# EAGLE design IOB-Outputs (EAGLE 7.7.0)
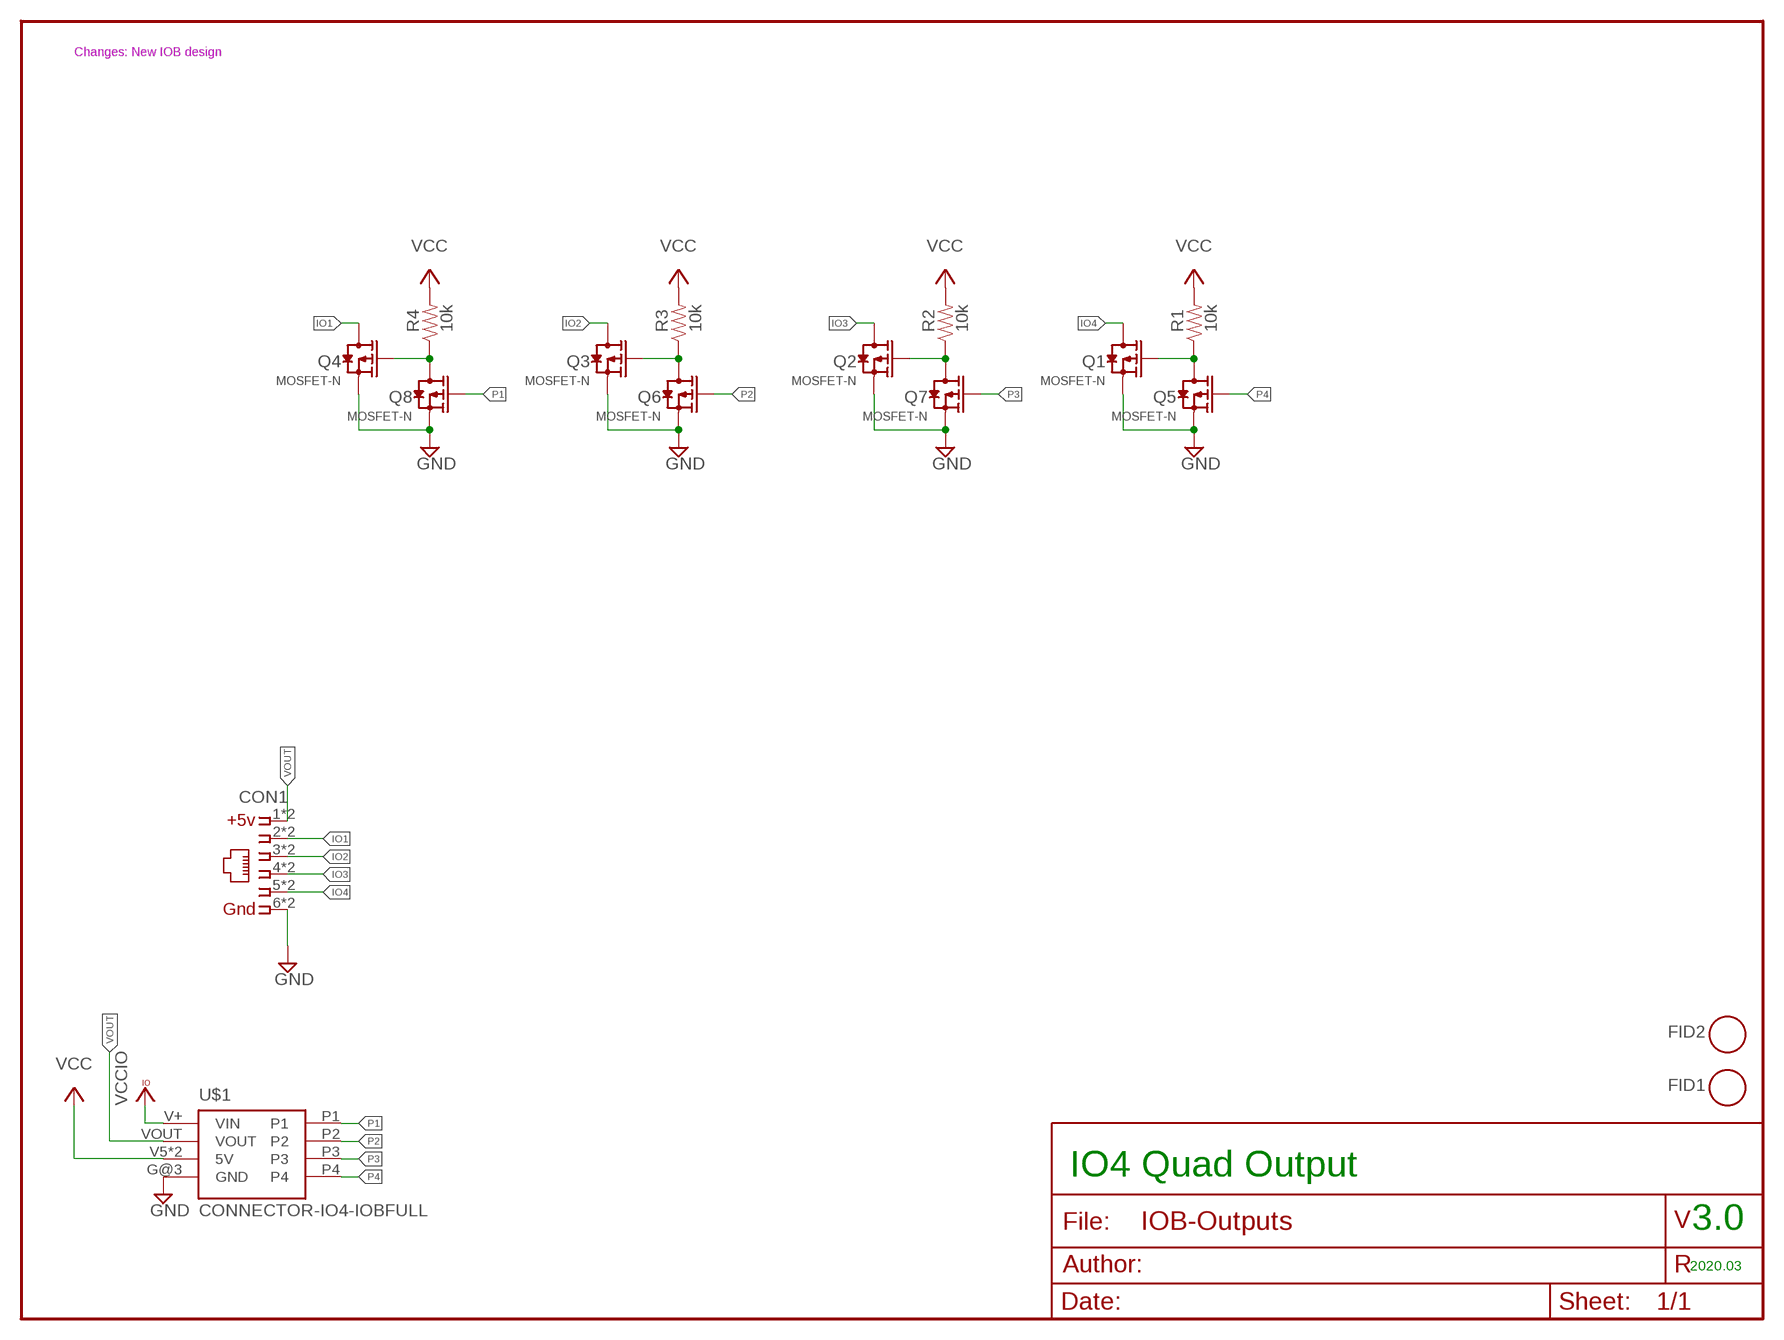
[diagram p0: schematic, sheet 1]

## Parts
CON1  CONNECTOR-IO4IPINS  [RJ24-INVERTED-PINS]
FID1  FIDUCIAL  [FIDUCIAL_1MM]
FID2  FIDUCIAL  [FIDUCIAL_1MM]
Q1  MOSFET-N  MOSFET-P  [SOT23-3]
Q2  MOSFET-N  MOSFET-P  [SOT23-3]
Q3  MOSFET-N  MOSFET-P  [SOT23-3]
Q4  MOSFET-N  MOSFET-P  [SOT23-3]
Q5  MOSFET-N  MOSFET-P  [SOT23-3]
Q6  MOSFET-N  MOSFET-P  [SOT23-3]
Q7  MOSFET-N  MOSFET-P  [SOT23-3]
Q8  MOSFET-N  MOSFET-P  [SOT23-3]
R1  10k  R0805-RES  [0805-RES]
R2  10k  R0805-RES  [0805-RES]
R3  10k  R0805-RES  [0805-RES]
R4  10k  R0805-RES  [0805-RES]
U$1  CONNECTOR-IO4-IOBFULL  [IO4-IOB]

## Nets
GND [Power]: CON1.6 CON1.6@1 Q1.2(S) Q2.2(S) Q3.2(S) Q4.2(S) Q5.2(S) Q6.2(S) Q7.2(S) Q8.2(S) U$1.G@3(GND)
IO1 [signals]: CON1.2 CON1.2@1 Q4.3(D)
IO2 [signals]: CON1.3 CON1.3@1 Q3.3(D)
IO3 [signals]: CON1.4 CON1.4@1 Q2.3(D)
IO4 [signals]: CON1.5 CON1.5@1 Q1.3(D)
N$1: Q4.1(G) Q8.3(D) R4.1
N$6: Q3.1(G) Q6.3(D) R3.1
N$7: Q2.1(G) Q7.3(D) R2.1
N$8: Q1.1(G) Q5.3(D) R1.1
P1 [signals]: Q8.1(G) U$1.P1
P2 [signals]: Q6.1(G) U$1.P2
P3 [signals]: Q7.1(G) U$1.P3
P4 [signals]: Q5.1(G) U$1.P4
VCC [Power]: R1.2 R2.2 R3.2 R4.2 U$1.V5(5V) U$1.V5@1(5V)
VIN: U$1.V+(VIN) ; supply symbol labelled VCCIO
VOUT: CON1.1 CON1.1@1 U$1.VOUT

## Notes on the sheet
- Changes: New IOB design
- IO4 Quad Output
- 3.0
- 2020.03

## Library data of the parts
CON1 = SPCoast:CONNECTOR-IO4
FID1 FID2 = SPCoast:FIDUCIAL: For use by pick and place machines to calibrate the vision/machine, 1mm By microbuilder.eu
Q1-Q8 = SPCoast:MOSFET-P: CJ2305：SMD MOSFET P-CH 8V-4.1A
R1-R4 = SPCoast:R*: Resistor Basic schematic elements and footprints for 0603, 1206, and PTH 1/10th watt (small) resistors.
U$1 = SPCoast:CONNECTOR-IO4-IOB

## Net classes
0 default: width 0.254 mm, drill 0.5 mm
1 Power: width 0.406 mm, drill 0.6 mm
2 signals: width 0.254 mm, drill 0.5 mm

## Board
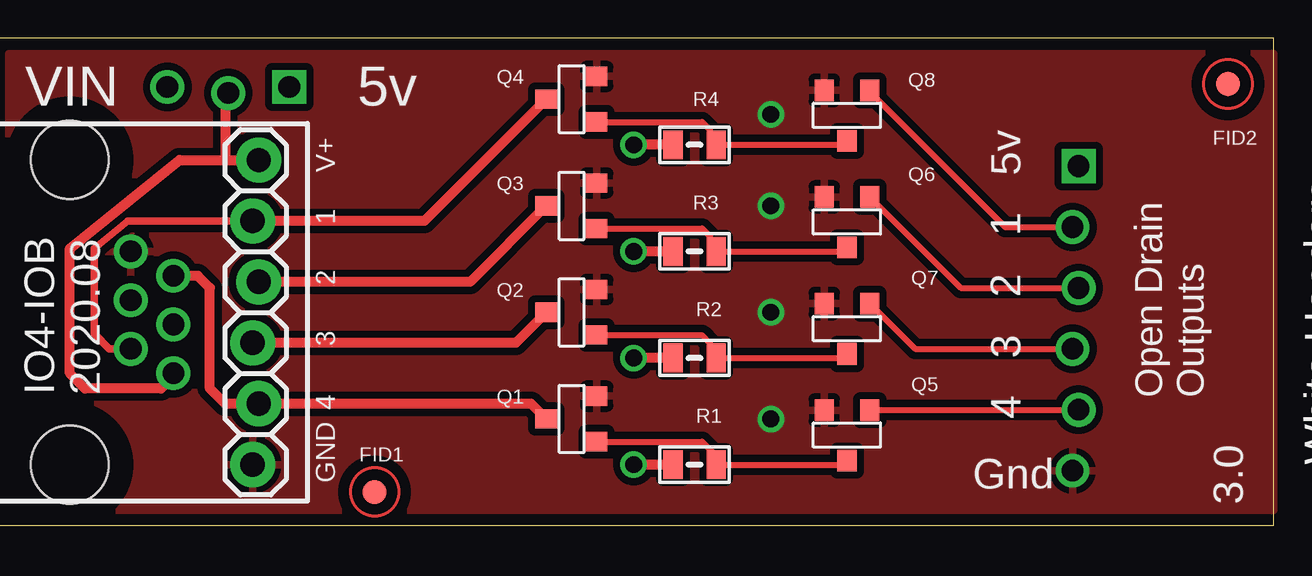
[diagram p1: board, top side]
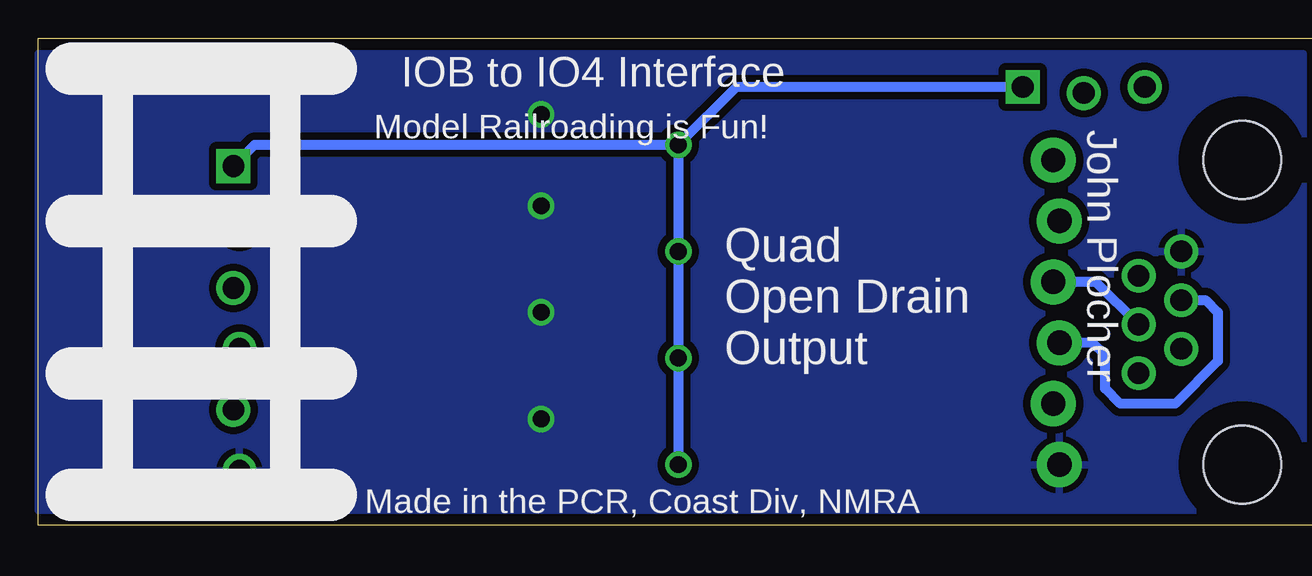
[diagram p2: board, bottom side, seen from below]

No outline drawn. Coordinates in mm, seen from the top.
Copper layers (1*16): Top 0.035mm / dielectric 1.5mm / Bottom 0.035mm
Design rules "default": minimum track width 10mil, minimum drill 24mil, track to track 8mil, track to pad 8mil, pad to pad 8mil, via to via 8mil, smd to smd 8mil, copper to edge 40mil, drill to drill 8mil, minimum pad ring 10mil, minimum via ring 8mil, stop-mask expansion 4mil, vias tented up to drill 0mil, thermal gap 10mil
Milling: 4 lines

### Footprints (pad centres in the part's own frame; a part is rotated, then mirrored left to right if it is on the bottom)
RJ24-INVERTED-PINS = drill 1.016 pad 1.88: 1 6.35,-4.064; 2 3.81,-3.81; 3 1.27,-4.064; 4 -1.27,-3.81; 5 -3.81,-4.064; 6 -6.35,-3.81 | drill 0.9 pad 1.4: 1@1 -2.54,-0.508; 2@1 -1.524,1.27; 3@1 -0.508,-0.508; 4@1 0.508,1.27; 5@1 1.524,-0.508; 6@1 2.54,1.27 | hole 3.251: 6.35,3.81; -6.35,3.81
FIDUCIAL_1MM = smd 1 x 1: 1 0,0
SOT23-3 = smd 0.9 x 0.8: 1 1,-0.95; 2 1,0.95; 3 -1.1,0
0805-RES = smd 0.8 x 1.2: 1 -0.9,0; 2 0.9,0
IO4-IOB = drill 0.9: G@3 44.958,2.286; P1 44.958,12.446; P2 45.212,9.906; P3 44.958,7.366; P4 45.212,4.826; V+ 7.239,18.288; VOUT 9.779,18.034 | drill 0.9 square: V5 12.319,18.288; V5@1 45.212,14.986

### Placement (x,y rotation side)
CON1  6.99,8.89 90 top
FID1  15.88,1.4 0 top
FID2  51.44,18.41 0 top
Q1  24.13,4.45 0 top
Q2  24.13,8.89 0 top
Q3  24.13,13.34 0 top
Q4  24.13,17.78 0 top
Q5  35.56,3.81 90 top
Q6  35.56,12.7 90 top
Q7  35.56,8.26 90 top
Q8  35.56,17.14 90 top
R1  29.21,2.54 180 top
R2  29.21,6.99 180 top
R3  29.21,11.43 180 top
R4  29.21,15.88 180 top
U$1  0,0 0 top

### Tracks (layer width: path | path; a pad name or v marks a point on that pad's centre or on a via)
GND  (via drill 0.7)
  Top 0.406: Q3.2 25.09,14.29 | Q2.2 25.09,9.84 | Q1.2 25.09,5.39
  other vias: 32.38,17.14 32.38,8.89 32.38,4.45 32.38,13.34
  pour Bottom (isolate 0.305): 0.64,0.64 0.64,19.68 53.34,19.68 53.34,0.64
  pour Top (isolate 0.305): 0.64,0.64 0.64,19.68 53.34,19.68 53.34,0.64
IO1
  Top 0.305: CON1.2@1 4.83,7.37 4.19,8 4.19,11.56 5.59,12.7 CON1.2
  Top 0.406: Q4.3 17.95,12.7 CON1.2
IO2
  Top 0.406: Q3.3 19.86,10.16 CON1.3
  Bottom 0.406: CON1.3@1 9.27,10.16 CON1.3
IO3
  Top 0.406: Q2.3 21.76,7.62 CON1.4
  Bottom 0.406: CON1.4@1 4.7,9.4 4.19,8.89 4.19,6.86 5.97,5.08 8.26,5.08 8.89,5.71 8.89,7.11 9.4,7.62 CON1.4
IO4
  Top 0.406: Q1.3 22.39,5.08 CON1.5 9.65,5.08 9.02,5.71 9.02,9.91 8.51,10.41 CON1.5@1
N$1
  Top 0.254: Q8.3 35.39,15.88 R4.1 29.84,16.14 29.84,16.51 29.52,16.83 Q4.1
N$6
  Top 0.254: Q6.3 35.39,11.43 R3.1 29.84,11.7 29.84,12.06 29.52,12.38 Q3.1
N$7
  Top 0.254: Q7.3 35.39,6.99 R2.1 29.84,7.25 29.84,7.62 29.52,7.94 Q2.1
N$8
  Top 0.254: 30.48,2.54 35.39,2.54 Q5.3 | Q1.1 29.52,3.5 30.48,2.54 | 30.48,2.54 R1.1
P1
  Top 0.254: Q8.1 36.51,18.1 42.16,12.45 U$1.P1
P2
  Top 0.254: Q6.1 40.3,9.91 U$1.P2
P3
  Top 0.254: Q7.1 38.4,7.37 U$1.P3
P4
  Top 0.254: Q5.1 36.53,4.83 U$1.P4
VCC  (via drill 0.7)
  Top 0.406: R4.2 v26.67,15.88 | R3.2 v26.67,11.43 | R2.2 v26.67,6.99 | R1.2 v26.67,2.54
  Bottom 0.406: v26.67,15.88 v26.67,11.43 v26.67,6.99 v26.67,2.54 | U$1.V5 24.26,18.29 v26.67,15.88 | U$1.V5@1 44.32,15.88 v26.67,15.88
VOUT
  Top 0.406: CON1.1@1 7.49,6.22 6.99,5.71 3.81,5.71 3.17,6.35 3.17,11.56 7.75,15.24 9.65,15.24 | 9.65,15.24 CON1.1 | U$1.VOUT 9.65,17.91 9.65,15.24

### Text on the board
tPlace: IO4-IOB | 2020.08 | Open Drain / Outputs | White Soldermask / Black Silkscreen | White Headers | 3.0
bPlace: John Plocher | Quad / Open Drain / Output
_tNames: Q4 | R4 | Q8 | FID2 | Q3 | R3 | Q6 | Q2 | Q7 | R2 | CON1 | Q5 | Q1 | R1 | FID1